# EAGLE design Driver (EAGLE 7.4.0)
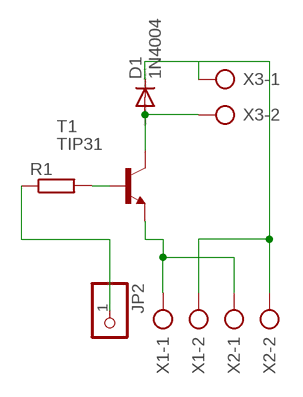
[diagram p0: schematic, sheet 1]

## Parts
D1  1N4004  [DO41-10]
JP2  PINHD-1X1  [1X01]
R1  R-EU_0204/2V  [0204V]
T1  TIP31  [TO220]
X1  AK500/2-H  [AK500/2-H]
X2  AK500/2-H  [AK500/2-H]
X3  AK500/2-H  [AK500/2-H]

## Nets
GND: T1.3(E) X1.1 X2.1
N$1: D1.A T1.2(C) X3.2
N$2: R1.2 T1.1(B)
N$4: JP2.1 R1.1
N$5: D1.C X1.2 X2.2 X3.1

## Library data of the parts
D1 = diode:1N4004: DIODE general purpose rectifier, 1 A
JP2 = pinhead:PINHD-1X1: PIN HEADER
R1 = rcl:R-EU_: RESISTOR, European symbol
T1 = transistor:TIP31: NPN Transistor Medium Power Linear Switching Applications Source: http://onsemi.com
X1-X3 = con-ptr500:AK500/2-H: CONNECTOR Aug. 2004 / PTR Meßtechnik: Die Bezeichnung der Serie AK505 wurde geändert. Es handelt sich hierbei um AK500 in horizontaler Ausführung.; OC_FARNELL: unknown; OC_NEWARK: unknown

## Board
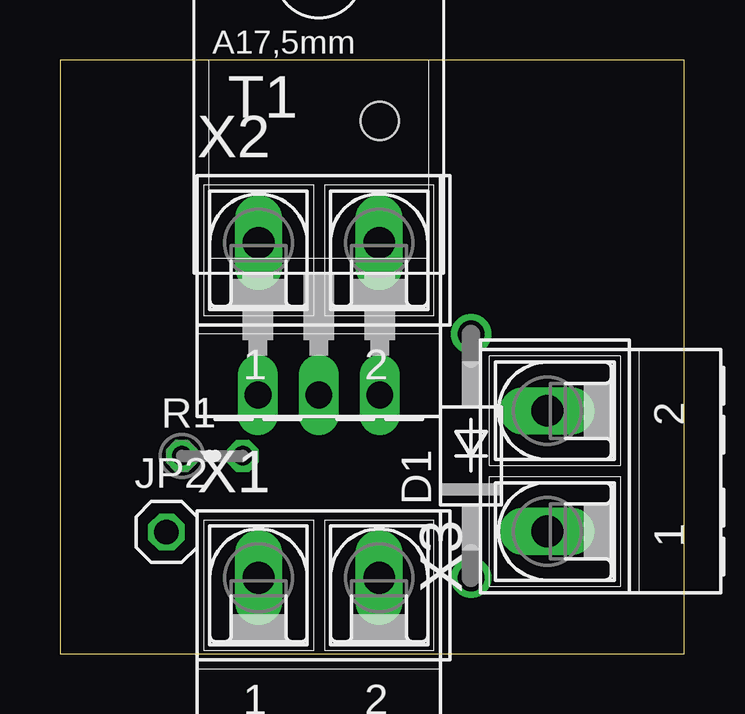
[diagram p1: board, top side]
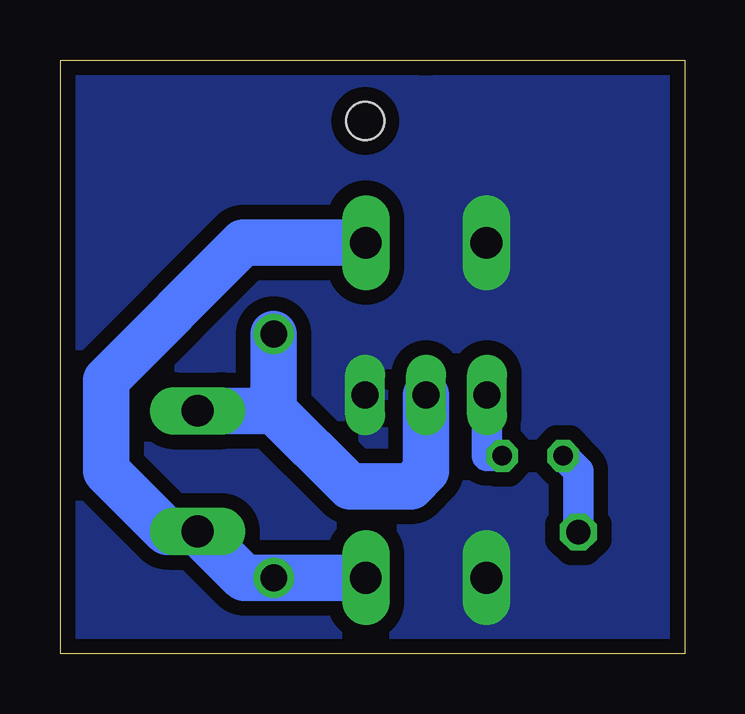
[diagram p2: board, bottom side, seen from below]

Size 26.04 x 24.77 mm. Coordinates in mm from the lower left corner, seen from the top.
Outline: 0,0 26.04,0 26.04,24.77 0,24.77 0,0
Copper layers (1*16): Top 0.035mm / dielectric 1.5mm / Bottom 0.035mm
Design rules "default *": minimum track width 24mil, minimum drill 24mil, track to track 24mil, track to pad 24mil, pad to pad 8mil, via to via 8mil, smd to smd 8mil, copper to edge 24mil, drill to drill 24mil, minimum pad ring 10mil, minimum via ring 8mil, stop-mask expansion 4mil, vias tented up to drill 0mil, thermal gap 0mil
Holes 1.6 mm at 13.34,22.23

### Footprints (pad centres in the part's own frame; a part is rotated, then mirrored left to right if it is on the bottom)
DO41-10 = drill 1.118: A 5.08,0; C -5.08,0
1X01 = drill 1.016 octagon: 1 0,0
0204V = drill 0.813 octagon: 1 -1.27,0; 2 1.27,0
TO220 = drill 1.118 long: 1 -2.54,-6.35; 2 0,-6.35; 3 2.54,-6.35
AK500/2-H = drill 1.321 long: 1 -2.515,0; 2 2.515,0

### Placement (x,y rotation side)
D1  17.14,8.26 90 top
JP2  4.45,5.08 0 top
R1  6.35,8.26 0 top
T1  10.79,17.15 0 top
X1  10.79,3.18 0 top
X2  10.79,17.15 0 top
X3  20.32,7.62 90 top

### Tracks (layer width: path | path; a pad name or v marks a point on that pad's centre or on a via)
GND
  pour Bottom: 0,24.77 26.04,24.77 26.04,0 0,0
N$1
  Bottom 1.93: D1.A 17.14,10.16 | 17.14,10.16 13.97,6.98 11.43,6.98 10.79,7.62 T1.2 | X3.2 17.14,10.13 17.14,10.16
N$2
  Bottom 1.27: T1.1 8.25,8.26 R1.2
N$4
  Bottom 1.27: R1.1 4.45,7.62 JP2.1
N$5
  Bottom 1.93: X1.2 D1.C 18.39,3.18 X3.1 20.34,5.08 21.59,5.08 24.13,7.62 24.13,11.43 18.41,17.15 X2.2